# Altium schematic sheet DAC_Diver_OPV.SchDoc
size A4; Organization: HTL Hollabrunn; Address1: Abteilung Elektronik; Address2: Anton Ehrenfried-Straße 10; Address3: 2020 Hollabrunn; SPICEModelCacheETVKZAQX: <root> / <DocumentId>ETVKZAQX</DocumentId> / <CacheFrame Number="0"> / <Model Name="cap" Kind="MDL"> / <Text>*Default semiconductor capacitor / .MODEL CAP C()</Text> / </Model> / <Model Name="ua741" Kind="CKT"> / <Text>*==================================================== / *uA741 / *Sngl GenPurpose OpAmp pkg:DIP8 3,2,7,4,6. pkg:CAN8 3,2,7,4,6. / * Connections: / *             Non-Inverting Input / *             | Inverting Input / *             | | Positive Power Supply / *             | | | Negative Power Supply / *             | | | | Output / *             | | | | | / .SUBCKT UA741 1 2 3 4 5 / C1   11 12 4.664E-12 / C2    6  7 20E-12 / DC    5 53 DX / DE   54  5 DX / DLP  90 91 DX / DLN  92 90 DX / DP    4  3 DX / BGND 99  0 V=V(3)*.5 + V(4)*.5 / BB    7 99 I=I(VB)*10.61E6 - I(VC)*10E6 + I(VE)*10E6 + / +              I(VLP)*10E6 - I(VLN)*10E6 / GA    6  0 11 12 137.7E-6 / GCM   0  6 10 99 2.574E-9 / IEE  10  4 DC 10.16E-6 / HLIM 90  0 VLIM 1K / Q1   11  2 13 QX / Q2   12  1 14 QX / R2    6  9 100E3 / RC1   3 11 7.957E3 / RC2   3 12 7.957E3 / RE1  13 10 2.74E3 / RE2  14 10 2.74E3 / REE  10 99 19.69E6 / RO1   8  5 150 / RO2   7 99 150 / RP    3  4 18.11E3 / VB    9  0 DC 0 / VC    3 53 DC 2.6 / VE   54  4 DC 2.6 / VLIM  7  8 DC 0 / VLP  91  0 DC 25 / VLN   0 92 DC 25 / .MODEL DX D(IS=800E-18) / .MODEL QX NPN(IS=800E-18 BF=62.5) / .ENDS UA741</Text> / </Model> / </CacheFrame> / </root>
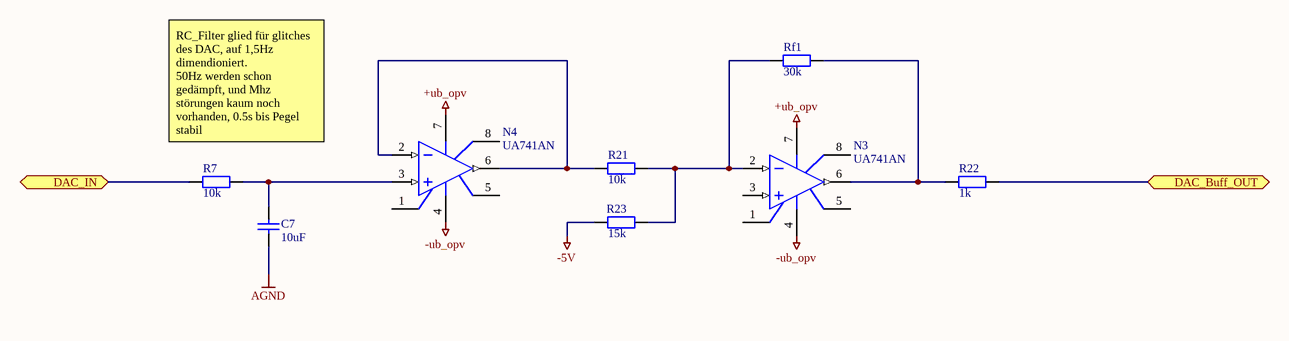
[diagram p0: DAC_Diver_OPV.SchDoc]

## Parts
C7  10uF  [C1206-KUE]
N3  UA741AN  [DIP8]
N4  UA741AN  [DIP8]
R7  10k  [C1206-KUE]
R21  10k  [C1206-KUE]
R22  1k  [C1206-KUE]
R23  15k  [C1206-KUE]
Rf1  30k  [C1206-KUE]

## Ports
DAC_Buff_OUT (bidir), DAC_IN (bidir)

## Nets
+ub_opv: N3.7(V+) N4.7(V+)
-5V: R23.2
-ub_opv: N3.4(V-) N4.4(V-)
AGND: C7.1
DAC_Buff_OUT: R22.1 ; port DAC_Buff_OUT
DAC_IN: R7.2 ; port DAC_IN
NetC7_2: C7.2 N4.3(IN+) R7.1
NetN3_2: N3.2(IN-) R21.1 R23.1 Rf1.2
NetN3_6: N3.6(OUT) R22.2 Rf1.1
NetN4_2: N4.2(IN-) N4.6(OUT) R21.2

Not connected (* = marked no-connect by the designer): N3 1(OS_NULL) 3(IN+) 5(OS_NULL) 8(NC); N4 1(OS_NULL) 5(OS_NULL) 8(NC)

## Notes on the sheet
- (near R7) RC_Filter glied für glitches des DAC, auf 1,5Hz dimendioniert.
  50Hz werden schon gedämpft, und Mhz störungen kaum noch vorhanden, 0.5s bis Pegel stabil
- Title
- Size:
- Date:
- A4
- Number:
- Time:
- Revision:
- Sheet
- of
- HTL Hollabrunn
- Abteilung Elektronik
- Anton Ehrenfried-Straße 10
- 2020 Hollabrunn
- File:
- Drawn By:

## Library data of the parts
C7 = Capacitor: Manufacturer: Kemet; Bezeichnung: Kerko +-10% 63V; Published: 8-Jun-2000; LatestRevisionDate: 17-Jul-2002; LatestRevisionNote: Re-released for DXP Platform.; PackageReference: RAD-0.3; Publisher: Altium Limited; PackageDescription: Radial Cap, Thru-Hole; 2 Leads; 0.3 in Pin Spacing; Value: 10uF; Orderingcode: *
N3 N4 = UA741AN: General-Purpose Single Operational Amplifier; Published: 24-Aug-2001; LatestRevisionDate: 06-Jun-2005; LatestRevisionNote: Stylized 3D Model Added.; DatasheetVersion: Oct-1997; PackageReference: DIP8; Publisher: Altium Limited; PackageDescription: DIP; 8 Leads; Row Spacing 7.62 mm; Pitch 2.54 mm; Code_JEDEC: MO-001-AN; ComponentLink1Description: Manufacturer Link; ComponentLink1URL: http://www.st.com/; ComponentLink2Description: Datasheet; ComponentLink2URL: http://www.st.com/stonline/products/literature/ds/5304/ua741.pdf
R7 R21-R23 Rf1 = ResistorSMD: Resistor SMD; Manufacturer: AVX; Bezeichnung: SMD Wid. 1/8W 2%; Published: 8-Jun-2000; LatestRevisionDate: 17-Jul-2002; LatestRevisionNote: Re-released for DXP Platform.; PackageReference: AXIAL-0.4; Publisher: Altium Limited; PackageDescription: Axial Device, Thru-Hole; 2 Leads; 0.4 in Pin Spacing; Orderingcode: *
  R7 R21: Value: 10k
  R22: Value: 1k
  R23: Value: 15k
  Rf1: Value: 30k